# EAGLE design linistepper with aligned transistors_my_version (EAGLE 7.6.0)
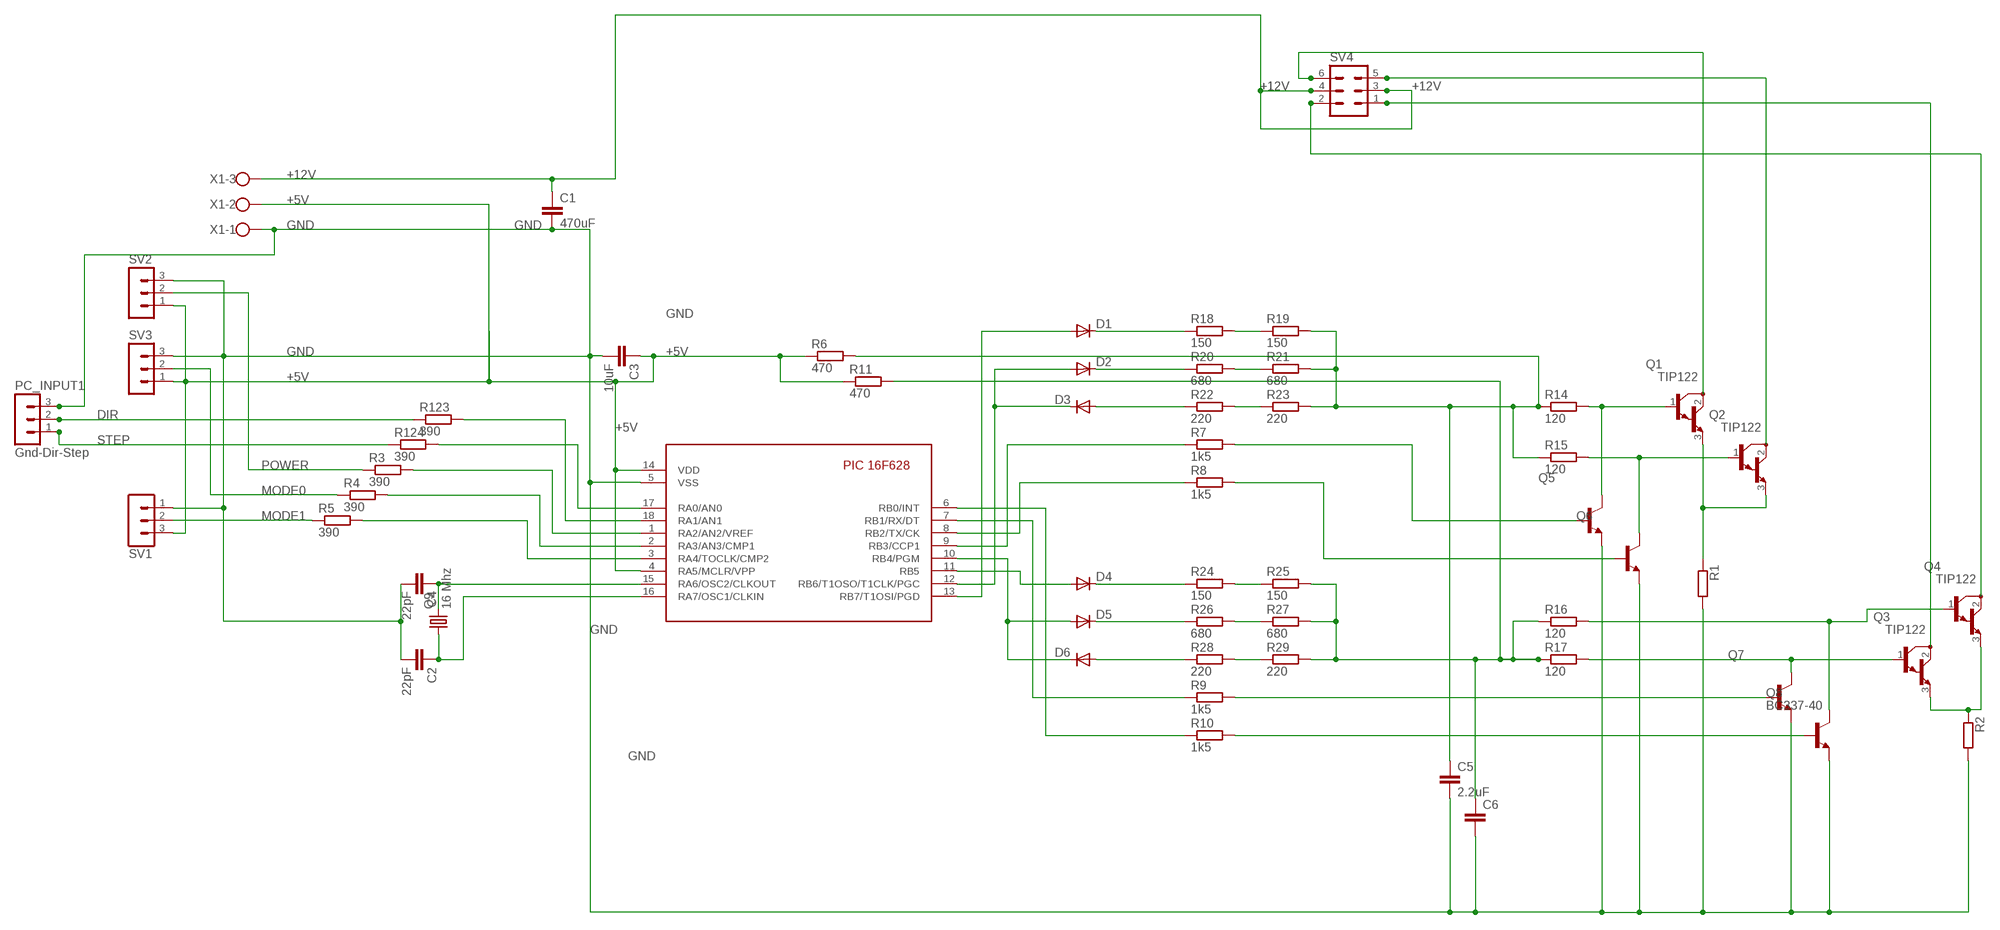
[diagram p0: schematic, sheet 1]

## Parts
C1  470uF  C-EU050-045X075  [C050-045X075]
C2  22pF  C-EU025-024X044  [C025-024X044]
C3  10uF  C-EU025-040X050  [C025-040X050]
C4  22pF  C-EU025-024X044  [C025-024X044]
C5  2.2uF  C-EU050-024X044  [C050-024X044]
C6  C-EU050-024X044  [C050-024X044]
D1  1N4148  [DO35-10]
D2  1N4148  [DO35-10]
D3  1N4148  [DO35-10]
D4  1N4148  [DO35-10]
D5  1N4148  [DO35-10]
D6  1N4148  [DO35-10]
PC_INPUT1  Gnd-Dir-Step  MA03-1  [MA03-1]
Q1  TIP122  [TO220]
Q2  TIP122  [TO220]
Q3  TIP122  [TO220]
Q4  TIP122  [TO220]
Q5  BC337-40  [TO92]
Q6  BC337-40  [TO92]
Q7  BC337-40  [TO92]
Q8  BC337-40  [TO92]
Q9  16 Mhz  CRYTALHC49S  [HC49/S]
R1  R-EU_0922/22  [0922/22]
R2  R-EU_0922/22  [0922/22]
R3  390  R-EU_0204/7  [0204/7]
R4  390  R-EU_0204/7  [0204/7]
R5  390  R-EU_0207/5V  [0207/5V]
R6  470  R-EU_0207/10  [0207/10]
R7  1k5  R-EU_0207/10  [0207/10]
R8  1k5  R-EU_0207/10  [0207/10]
R9  1k5  R-EU_0207/10  [0207/10]
R10  1k5  R-EU_0207/10  [0207/10]
R11  470  R-EU_0207/12  [0207/12]
R14  120  R-EU_0207/10  [0207/10]
R15  120  R-EU_0207/10  [0207/10]
R16  120  R-EU_0207/10  [0207/10]
R17  120  R-EU_0207/10  [0207/10]
R18  150  R-EU_0207/2V  [0207/2V]
R19  150  R-EU_0207/2V  [0207/2V]
R20  680  R-EU_0207/2V  [0207/2V]
R21  680  R-EU_0207/2V  [0207/2V]
R22  220  R-EU_0207/2V  [0207/2V]
R23  220  R-EU_0207/2V  [0207/2V]
R24  150  R-EU_0207/2V  [0207/2V]
R25  150  R-EU_0207/2V  [0207/2V]
R26  680  R-EU_0207/2V  [0207/2V]
R27  680  R-EU_0207/2V  [0207/2V]
R28  220  R-EU_0207/2V  [0207/2V]
R29  220  R-EU_0207/2V  [0207/2V]
R123  390  R-EU_0207/2V  [0207/2V]
R124  390  R-EU_0207/2V  [0207/2V]
SV1  MA03-1  [MA03-1]
SV2  MA03-1  [MA03-1]
SV3  MA03-1  [MA03-1]
SV4  MA03-2  [MA03-2]
U$1  16F628  [PIC16F628-18-LEAD-PDIP]
X1  W237-103  [W237-103]

## Nets
+5V: C3.1 R6.1 R11.1 SV1.3 SV2.1 SV3.1 U$1.4(RA5/MCLR/VPP) U$1.14(VDD) X1.2
+12V: C1.1 SV4.3 SV4.4 X1.3
DIR: PC_INPUT1.2 R123.1
GND: C1.2 C2.2 C3.2 C4.2 C5.2 C6.2 PC_INPUT1.3 Q5.1(E) Q6.1(E) Q7.1(E) Q8.1(E) R1.2 R2.2 SV1.1 SV2.3 SV3.3 U$1.5(VSS) X1.1
MODE0: R4.1 SV3.2
MODE1: R5.1 SV1.2
N$1: R18.2 R19.1
N$2: C5.1 R6.2 R14.1 R15.1 R19.2 R21.2 R23.2
N$3: R20.2 R21.1
N$5: Q1.1(B) Q5.3(C) R14.2
N$6: Q2.1(B) Q6.3(C) R15.2
N$7: D1.C R18.1
N$8: D2.C R20.1
N$9: D3.A R22.1
N$10: D1.A U$1.13(RB7/T1OSI/PGD)
N$11: D2.A D3.C U$1.12(RB6/T1OSO/T1CLK/PGC)
N$12: R8.1 U$1.8(RB2/TX/CK)
N$13: R7.1 U$1.9(RB3/CCP1)
N$14: Q5.2(B) R7.2
N$15: Q6.2(B) R8.2
N$16: Q1.3(E) Q2.3(E) R1.1
N$17: R3.2 U$1.1(RA2/AN2/VREF)
N$18: R4.2 U$1.2(RA3/AN3/CMP1)
N$19: R24.2 R25.1
N$20: D5.C R26.1
N$21: R26.2 R27.1
N$22: D6.A R28.1
N$23: R28.2 R29.1
N$24: D4.A U$1.11(RB5)
N$25: D5.A D6.C U$1.10(RB4/PGM)
N$26: R9.1 U$1.7(RB1/RX/DT)
N$27: R10.1 U$1.6(RB0/INT)
N$28: C6.1 R11.2 R16.1 R17.1 R25.2 R27.2 R29.2
N$29: Q4.1(B) Q8.3(C) R16.2
N$30: Q8.2(B) R10.2
N$31: Q3.1(B) Q7.3(C) R17.2
N$32: Q7.2(B) R9.2
N$33: Q3.3(E) Q4.3(E) R2.1
N$34: Q1.2(C) SV4.6
N$35: Q2.2(C) SV4.5
N$36: Q3.2(C) SV4.1
N$37: Q4.2(C) SV4.2
N$39: R124.2 U$1.17(RA0/AN0)
N$41: R123.2 U$1.18(RA1/AN1)
N$43: C2.1 Q9.1 U$1.16(RA7/OSC1/CLKIN)
N$44: C4.1 Q9.2 U$1.15(RA6/OSC2/CLKOUT)
N$48: R5.2 U$1.3(RA4/TOCLK/CMP2)
POWER: R3.1 SV2.2
R23: R22.2 R23.1
R24: D4.C R24.1
STEP: PC_INPUT1.1 R124.1

## Library data of the parts
C1-C6 = rcl:C-EU: CAPACITOR, European symbol
D1-D6 = diode:1N4148: DIODE high speed (Philips)
PC_INPUT1 SV1-SV3 = con-lstb:MA03-1: PIN HEADER
Q1-Q4 = transistor-npn:TIP122*: NPN Darlington Transistor
Q5-Q8 = transistor-npn:BC337*: NPN Transistor
Q9 = crystal:CRYTAL: CRYSTAL
R1-R11 R14-R29 R123 R124 = rcl:R-EU_: RESISTOR, European symbol
SV4 = con-lstb:MA03-2: PIN HEADER
U$1 = pic16f6xx:16F628: Microchip component PIC 16F628 Eric Magraner - eric_magraner@yahoo.fr 03/2004
X1 = con-wago-500:W237-103: WAGO SCREW CLAMP

## Board
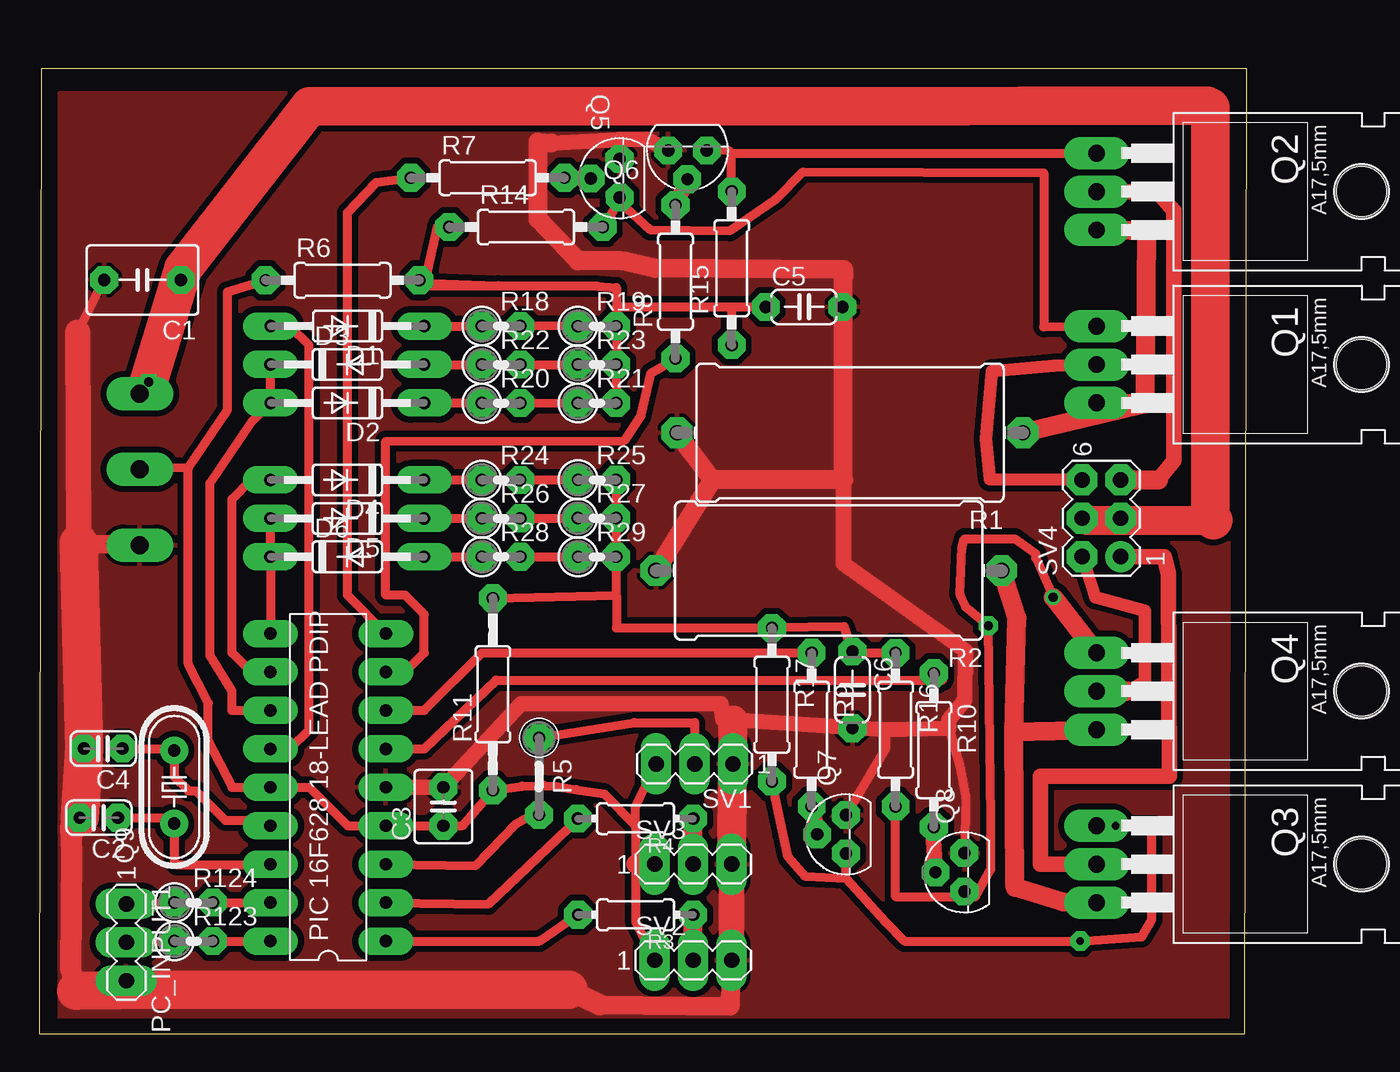
[diagram p1: board, top side]
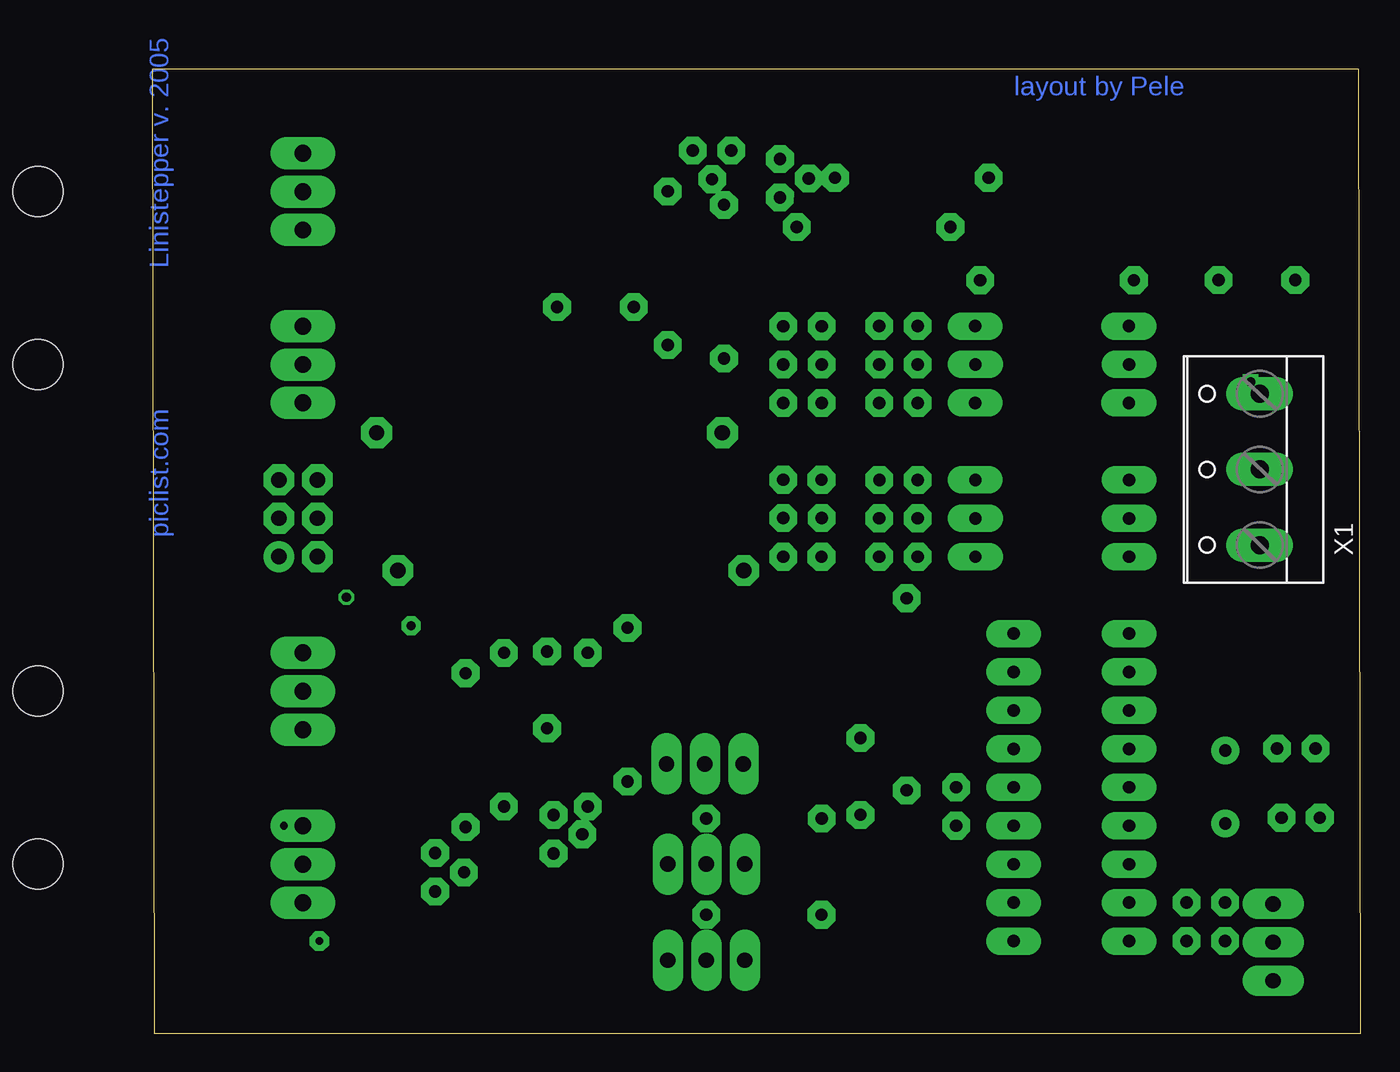
[diagram p2: board, bottom side, seen from below]

Size 79.85 x 63.79 mm. Coordinates in mm from the lower left corner, seen from the top.
Outline: 0,0 79.71,0 79.85,63.79 0.14,63.79 0,0
Copper layers (1*16): Top 0.035mm / dielectric 1.5mm / Bottom 0.035mm
Design rules "default *": minimum track width 10mil, minimum drill 24mil, track to track 8mil, track to pad 8mil, pad to pad 8mil, via to via 8mil, smd to smd 8mil, copper to edge 40mil, drill to drill 8mil, minimum pad ring 20mil, minimum via ring 8mil, stop-mask expansion 4mil, vias tented up to drill 0mil, thermal gap 10mil

### Footprints (pad centres in the part's own frame; a part is rotated, then mirrored left to right if it is on the bottom)
C050-045X075 = drill 0.813 octagon: 1 -2.54,0; 2 2.54,0
C025-024X044 = drill 0.813 octagon: 1 -1.27,0; 2 1.27,0
C025-040X050 = drill 0.813 octagon: 1 -1.27,0; 2 1.27,0
C050-024X044 = drill 0.813 octagon: 1 -2.54,0; 2 2.54,0
DO35-10 = drill 0.813 long: A 5.08,0; C -5.08,0
MA03-1 = drill 1.016 long: 1 -2.54,0; 2 0,0; 3 2.54,0
TO220 = drill 1.118 long: 1 -2.54,-6.35; 2 0,-6.35; 3 2.54,-6.35 | hole 3.302: 0,11.176
TO92 = drill 0.813 octagon: 1 1.27,0; 2 0,1.905; 3 -1.27,0
HC49/S = drill 0.813: 1 -2.413,0; 2 2.413,0
0922/22 = drill 1.016 octagon: 1 -11.43,0; 2 11.43,0
0204/7 = drill 0.813 octagon: 1 -3.81,0; 2 3.81,0
0207/5V = drill 0.813 octagon: 1 -2.54,0; 2 2.54,0
0207/10 = drill 0.813 octagon: 1 -5.08,0; 2 5.08,0
0207/12 = drill 0.813 octagon: 1 -6.35,0; 2 6.35,0
0207/2V = drill 0.813 octagon: 1 -1.27,0; 2 1.27,0
MA03-2 = drill 1.016: 1 -2.54,-1.27 | drill 1.016 octagon: 2 -2.54,1.27; 3 0,-1.27; 4 0,1.27; 5 2.54,-1.27; 6 2.54,1.27
PIC16F628-18-LEAD-PDIP = drill 0.813 long: 1 -10.16,-3.81; 2 -7.62,-3.81; 3 -5.08,-3.81; 4 -2.54,-3.81; 5 0,-3.81; 6 2.54,-3.81; 7 5.08,-3.81; 8 7.62,-3.81; 9 10.16,-3.81; 10 10.16,3.81; 11 7.62,3.81; 12 5.08,3.81; 13 2.54,3.81; 14 0,3.81; 15 -2.54,3.81; 16 -5.08,3.81; 17 -7.62,3.81; 18 -10.16,3.81
W237-103 = drill 1.194 long: 1 -5,-1.29; 2 0,-1.29; 3 5,-1.29

### Placement (x,y rotation side)
C1  6.85,49.83 180 top
C2  3.96,14.29 180 top
C3  26.74,15.03 90 top
C4  4.25,18.86 180 top
C5  50.58,48.05 0 top
C6  53.78,22.74 270 top
D1  20.4,46.78 180 top
D2  20.39,41.7 180 top
D3  20.38,44.24 0 top
D4  20.39,36.61 180 top
D5  20.39,34.07 180 top
D6  20.38,31.53 0 top
PC_INPUT1  5.77,6.06 270 top
Q1  76.27,44.24 270 top
Q2  76.27,55.67 270 top
Q3  76.27,11.22 270 top
Q4  76.27,22.65 270 top
Q5  38.38,56.54 90.1 top
Q6  42.87,58.39 180 top
Q7  53.35,13.19 90 top
Q8  61.17,10.68 90 top
Q9  8.94,16.32 90 top
R1  53.61,39.73 180 top
R2  52.21,30.62 180 top
R3  39.44,7.87 180 top
R4  39.43,14.23 180 top
R5  33.06,17.02 270 top
R6  20.06,49.81 0 top
R7  29.66,56.58 0 top
R8  42.08,49.71 90 top
R9  51.08,20.11 270 top
R10  59.16,18.76 270 top
R11  30.01,22.45 90 top
R14  32.19,53.32 0 top
R15  45.79,50.6 90 top
R16  56.63,20.1 270 top
R17  48.46,21.76 270 top
R18  30.55,46.79 0 top
R19  36.9,46.77 0 top
R20  30.55,41.69 0 top
R21  36.9,41.69 0 top
R22  30.55,44.24 0 top
R23  36.9,44.24 0 top
R24  30.54,36.61 0 top
R25  36.9,36.62 0 top
R26  30.54,34.08 0 top
R27  36.9,34.09 0 top
R28  30.55,31.53 0 top
R29  36.9,31.53 0 top
R123  10.23,6.14 0 top
R124  10.23,8.68 0 top
SV1  43.34,17.85 180 top
SV2  43.25,4.87 0 top
SV3  43.25,11.22 0 top
SV4  70.24,34.08 90 top
U$1  19.12,16.3 90 top
X1  7.95,37.3 90 bottom

### Tracks (layer width: path | path; a pad name or v marks a point on that pad's centre or on a via)
+5V
  Top 0.254: R6.1 15.31,50.59
  Top 0.61: R6.1 12.47,49.05 12.47,41.26 9.88,37.4 | 9.88,37.4 X1.2 | 9.88,37.4 9.88,24.46 11.2,21.87 11.2,19.33 12.77,16.3 U$1.14 17.85,16.3 20.39,13.76 U$1.4 C3.1 28.01,13.76 R11.1 31.96,16.38 33.41,16.4 34.15,16.37 35.52,16.14 37.36,15.86 39.44,13.76 | SV2.1 39.44,7.41 39.44,11.22 39.44,13.76 | SV1.3 39.44,15.03 39.44,13.76
  Top 1.27: 39.44,11.22 SV3.1
+12V  (via drill 0.6)
  Top 0.254: 9.53,50.57 C1.1
  Top 0.61: X1.3 v7.26,43.09
  Top 1.27: SV4.4 SV4.3
  Top 1.93: SV4.4 69.1,33.95 77.64,33.95
  Top 2.54: v7.26,43.09 9.53,50.57 17.9,61.31 61.33,61.31 64.92,61.34 77.25,61.34 77.45,61.23 77.45,34.14 77.64,33.95
DIR
  Top 0.61: PC_INPUT1.2 R123.1
GND
  Top 0.254: X1.1 2.61,32.81 | 2.46,2.87 PC_INPUT1.3
  Top 0.61: Q7.1 55.95,18.84 55.95,20.11 C6.2 | 60.16,20.19 60.89,17.68 61.27,15.6 Q8.1 | 2.58,46.36 C1.2
  Top 1.016: U$1.5 C3.2 31.86,21.83 45.08,21.84 45.22,20.75 45.88,20.75 55.95,20.11 60.16,20.19 60.16,20.75 61.21,22.07 61.23,25.33 53.19,31.08 53.19,36.62 | 38.27,59.11 40.18,59.13 Q6.1 | 38.27,59.11 Q5.1 | 33.88,58.87 38.27,59.11
  Top 1.27: 2.1,13.64 C2.2 | 44.52,36.62 R2.2 | 44.52,36.62 53.19,36.62 53.19,50.51 | 44.52,36.62 R1.2 | 53.19,50.51 C5.2 | 2.63,32.44 X1.1 | 33.88,58.87 32.98,58.94 32.98,53.86 35.63,51.08 38.55,51.08 40.71,50.59 53.19,50.51 | 37.06,1.94 45.71,1.84 SV2.3
  Top 1.422: 2.1,13.64 2.15,11.93 2.09,4.3 2.46,2.87 | 35.01,2.93 37.06,1.94
  Top 1.676: 2.63,32.44 2.58,46.36 | SV2.3 SV3.3
  Top 1.93: SV3.3 SV1.1 45.88,20.75
  Top 2.54: C2.2 C4.2 2.63,32.44 | 35.01,2.93 8.31,2.93 2.46,2.87
  pour Top (isolate 0.406): 1.38,62.18 78.77,62.24 78.77,1.06 1.36,1.06
MODE0
  Top 1.27: SV3.2 R4.1
MODE1
  Top 0.61: SV1.2 43.34,20.57 39.34,20.57 R5.1
N$1
  Top 0.254: R19.1
  Top 0.61: R19.1 R18.2
N$2
  Top 0.254: 45.79,48.05 45.8,46.77 | R21.2 | 36.9,49.42 30.35,49.61 R6.2 | R23.2 R19.2 | R15.1 45.79,46.78
  Top 0.406: 45.79,48.05 R15.1 | R23.2 38.17,42.97
  Top 0.61: 38.17,48.05 45.79,48.05 | R21.2 38.17,42.97 R23.2 | 38.17,48.05 38.17,49.32 36.9,49.42 25.47,49.42 26.34,53.33 R14.1 | 38.17,48.05 R23.2 | 45.79,48.05 45.79,46.78 | 45.79,48.05 47.3,48.05 C5.1
N$3
  Top 0.254: R21.1
  Top 0.61: R20.2 R21.1
N$5
  Top 0.61: R14.2 37.97,54.39 38.07,54.6 38.42,54.95 | 38.42,54.95 40.41,53.16 45.68,53.09 48.72,55.17 50.51,56.96 66.42,56.91 66.43,46.72 Q1.1 | 38.42,54.95 Q5.3
  Top 1.27: 68.77,46.78 Q1.1
N$6
  Top 0.61: R15.2 45.79,58.21 | Q6.3 45.58,58.39 45.79,58.21 | 45.79,58.21 Q2.1
N$7
  Top 0.61: D1.C 26.74,46.78 28.01,46.78 R18.1
N$8
  Top 0.61: D2.C 26.74,41.7 28.01,41.7 R20.1
N$9
  Top 0.61: R22.1 28.01,44.24 26.74,44.24 D3.A
N$10
  Top 0.61: U$1.13 16.58,18.84 17.85,20.11 17.85,45.51 16.58,46.78 D1.A
N$11
  Top 0.254: D2.A
  Top 0.61: D2.A 15.31,42.97 D3.C | U$1.12 12.77,21.38 12.77,22.65 11.31,24.99 11.31,36.42 14.04,40.43 D2.A
N$12
  Top 0.61: U$1.8 24.2,23.92 25.47,25.19 25.47,27.73 24.2,29 22.93,29 22.93,39.16 38.7,39.21 39.81,40.85 40.45,43.66 R8.1
N$13
  Top 0.61: U$1.9 20.39,29 20.39,54.27 22.3,56.27 R7.1
N$14
  Top 1.016: R7.2 Q5.2
N$15
  Top 1.016: R8.2 Q6.2
N$16
  Top 1.27: 73.15,41.63 Q1.3 | R1.1 73.15,41.63 | 73.15,41.63 73.23,53.06 Q2.3
N$17
  Top 0.61: U$1.1 33.09,6.14 R3.2
N$18
  Top 0.61: U$1.2 29.67,8.58 R4.2
N$19
  Top 0.254: R25.1
  Top 0.61: R24.2 R25.1
N$20
  Top 0.61: D5.C 26.74,34.08 28.01,34.08 R26.1
N$21
  Top 0.254: R27.1
  Top 0.61: R26.2 R27.1
N$22
  Top 0.61: D6.A 26.74,31.54 28.01,31.54 R28.1
N$23
  Top 0.254: R29.1
  Top 0.61: R28.2 R29.1
N$24
  Top 0.61: U$1.11 14.04,23.92 12.77,25.19 12.77,35.35 14.04,36.62 D4.A
N$25
  Top 0.254: D5.A | D6.C
  Top 0.61: U$1.10 D6.C D5.A
N$26
  Top 0.61: U$1.7 25.47,21.38 29.28,25.19 R9.1
N$27
  Top 0.61: R10.1 59.76,23.38 30.22,23.38 25.47,18.84 U$1.6
N$28
  Top 0.254: R25.2 | R29.2 | 53.79,25.19 C6.1
  Top 0.61: R25.2 R27.2 R29.2 38.17,29 | R16.1 53.79,25.19 53.22,26.92 R17.1 38.17,26.84 38.17,29 | R11.2 38.17,29
N$29  (via drill 0.6 pad 0.81, 0.6 pad 1.27)
  Top 0.61: 61.92,9.07 56.62,9.07 R16.2 | 61.92,9.07 Q8.3 | 61.92,9.07 62.92,10.88 62.92,14.42 62.89,16.54 v62.76,26.98 61.27,28.21 60.89,29.06 61.03,32.14 61.19,32.71 64.51,32.71 65.89,31.74 65.89,31.46 v67.05,28.86
  Top 1.27: v67.05,28.86 Q4.1
N$30
  Top 0.61: 59.11,13.28 R10.2
  Top 1.016: Q8.2 59.11,13.28
N$31  (via drill 0.5 pad 1.27)
  Top 0.61: 53.35,10.27 50.63,10.44 49.52,11.71 R17.2 | 53.35,10.27 Q7.3 | 53.35,10.27 55.95,7.41 57.22,6.14 v68.83,6.14 72.9,6.41 73.57,7.55 73.57,13.36 73.63,13.77 73.74,13.77 Q3.1
  Top 1.27: v71.19,13.76 Q3.1
N$32
  Top 0.61: 51.38,13.92 Q7.2 | R9.2 51.63,14.72
  Top 1.016: R9.2 51.38,13.92
N$33
  Top 1.27: 64.46,19.97 64.66,27.5 R2.1 | 64.46,19.97 64.53,9.68 67.62,8.75 Q3.3 | 64.46,19.97 Q4.3
N$34
  Top 0.813: Q1.2 67.09,44.16 63,43.78 62.6,39.32 62.87,36.65 SV4.6
N$35
  Top 1.016: 74.01,36.62 75.01,37.89 75.01,54.4 73.93,55.67 Q2.2
  Top 1.27: SV4.5 74.01,36.62
N$36
  Top 1.016: Q3.2 66.2,11.22 66.19,13.91 66.19,17.02 74.73,17.02 74.67,30.4 74.39,31.54 SV4.1
N$37
  Top 0.813: 71.97,22.65 73.11,23.35 73.11,27.96 69.84,28.86 SV4.2
  Top 1.27: Q4.2 71.97,22.65
N$39
  Top 0.61: R124.2 U$1.17
N$41
  Top 0.61: R123.2 U$1.18
N$43
  Top 0.61: C2.1 8.55,14.29 Q9.1 8.94,11.35 9.1,11.19 15.28,11.19 U$1.16
N$44
  Top 0.61: C4.1 8.82,18.86 Q9.2 8.94,17 9.88,16.06 10.37,16.06 12.31,14.11 14.96,14.11 U$1.15
N$48
  Top 0.61: U$1.3 28.85,11.12 31.57,13.91 32.75,14.55 R5.2
POWER
  Top 1.27: SV2.2 R3.1
R23
  Top 0.254: R23.1
  Top 0.61: R22.2 R23.1
R24
  Top 0.61: D4.C 26.74,36.62 28.01,36.62 R24.1
STEP
  Top 0.61: PC_INPUT1.1 R124.1

### Text on the board
Bottom: Linistepper v. 2005 | layout by Pele | piclist.com